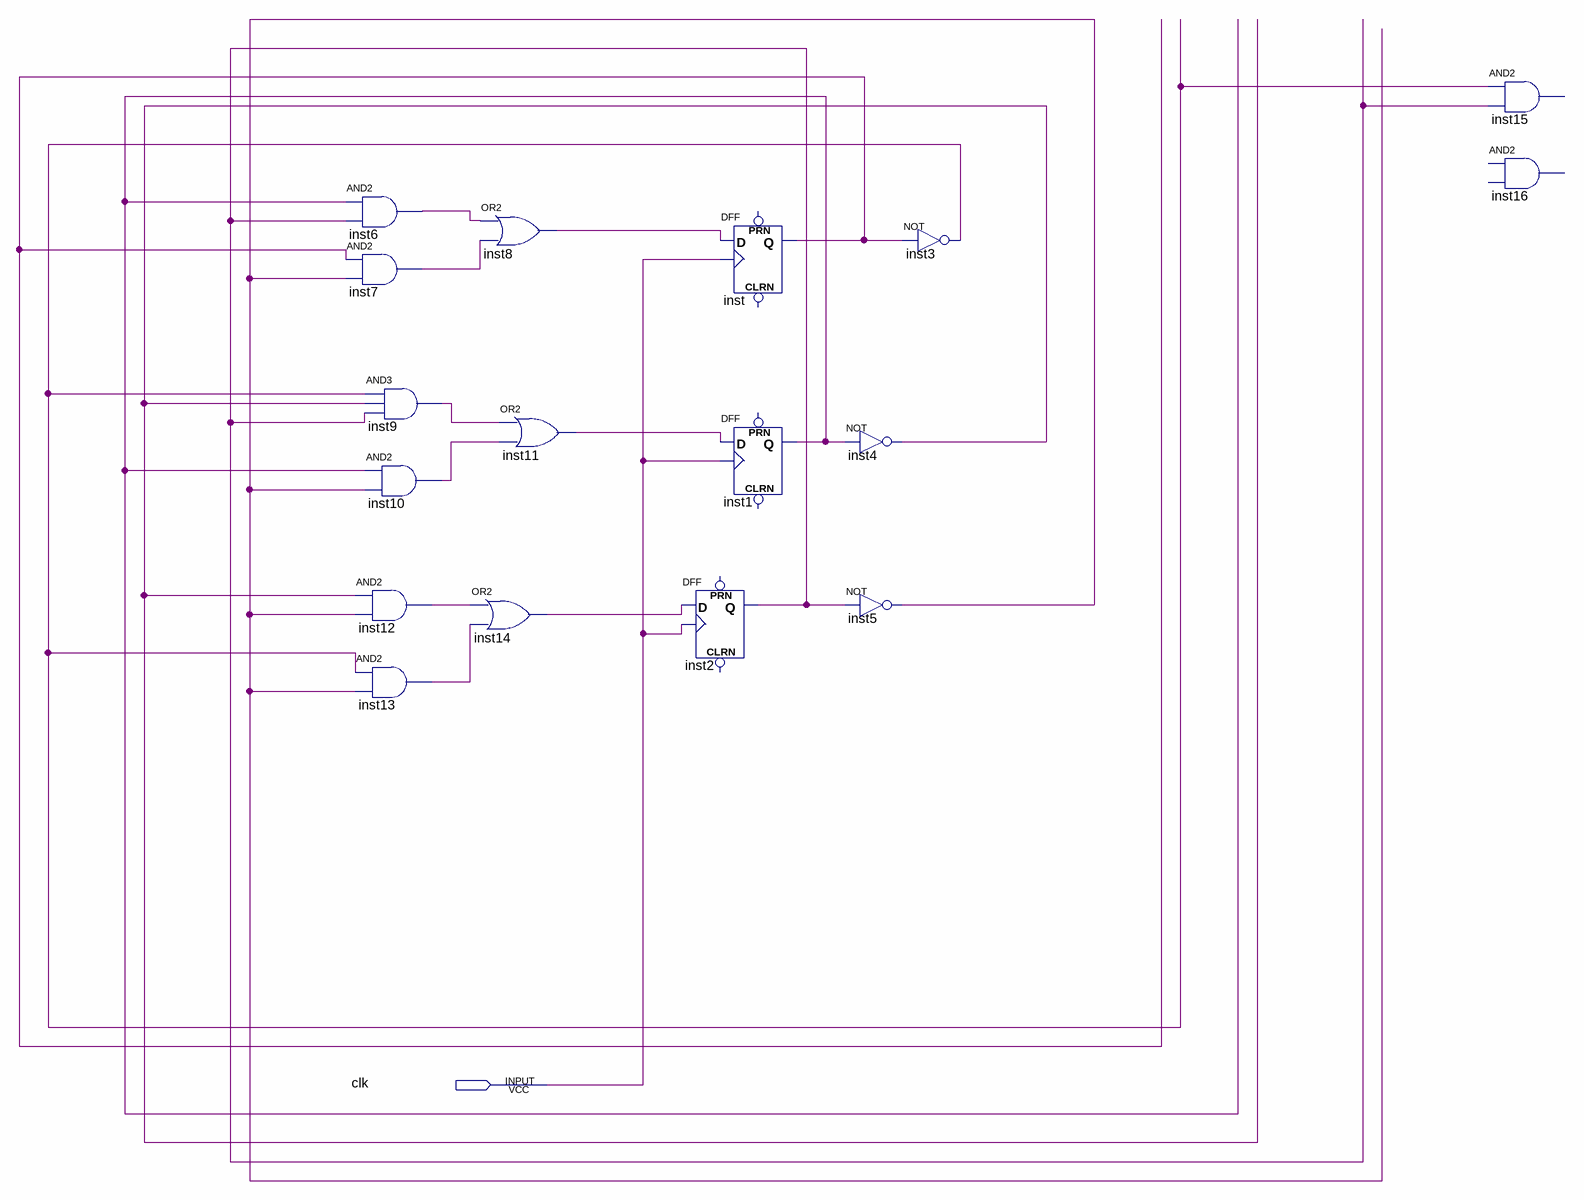
[diagram p0: schematic sheet]
// Quartus schematic greenFND.bdf as structural Verilog: 17 symbols, 1 pins
module greenFND (
  input  clk
);

  wire inst1_q, inst2_q, inst3_out, inst4_out, inst5_out, inst6_out, inst7_out, inst8_out, inst9_out,
       inst10_out, inst11_out, inst12_out, inst13_out, inst14_out, inst_q;

  and inst6 (inst6_out, inst1_q, inst2_q);
  and inst7 (inst7_out, inst_q, inst5_out);
  and inst9 (inst9_out, inst3_out, inst4_out, inst2_q);
  and inst10 (inst10_out, inst1_q, inst5_out);
  and inst12 (inst12_out, inst4_out, inst5_out);
  and inst13 (inst13_out, inst3_out, inst5_out);
  or inst8 (inst8_out, inst6_out, inst7_out);
  or inst11 (inst11_out, inst9_out, inst10_out);
  or inst14 (inst14_out, inst12_out, inst13_out);
  DFF inst2 (.CLK(clk), .D(inst14_out), .Q(inst2_q));  // open: CLRN, PRN
  DFF inst (.CLK(clk), .D(inst8_out), .Q(inst_q));  // open: CLRN, PRN
  DFF inst1 (.CLK(clk), .D(inst11_out), .Q(inst1_q));  // open: CLRN, PRN
  not inst3 (inst3_out, inst_q);
  not inst4 (inst4_out, inst1_q);
  not inst5 (inst5_out, inst2_q);
  // AND2 inst15 has open pins: IN1=inst3_out, IN2=inst2_q, OUT=open
  // AND2 inst16 is placed but not wired
endmodule
